# Altium project Weather Station.PrjPcb
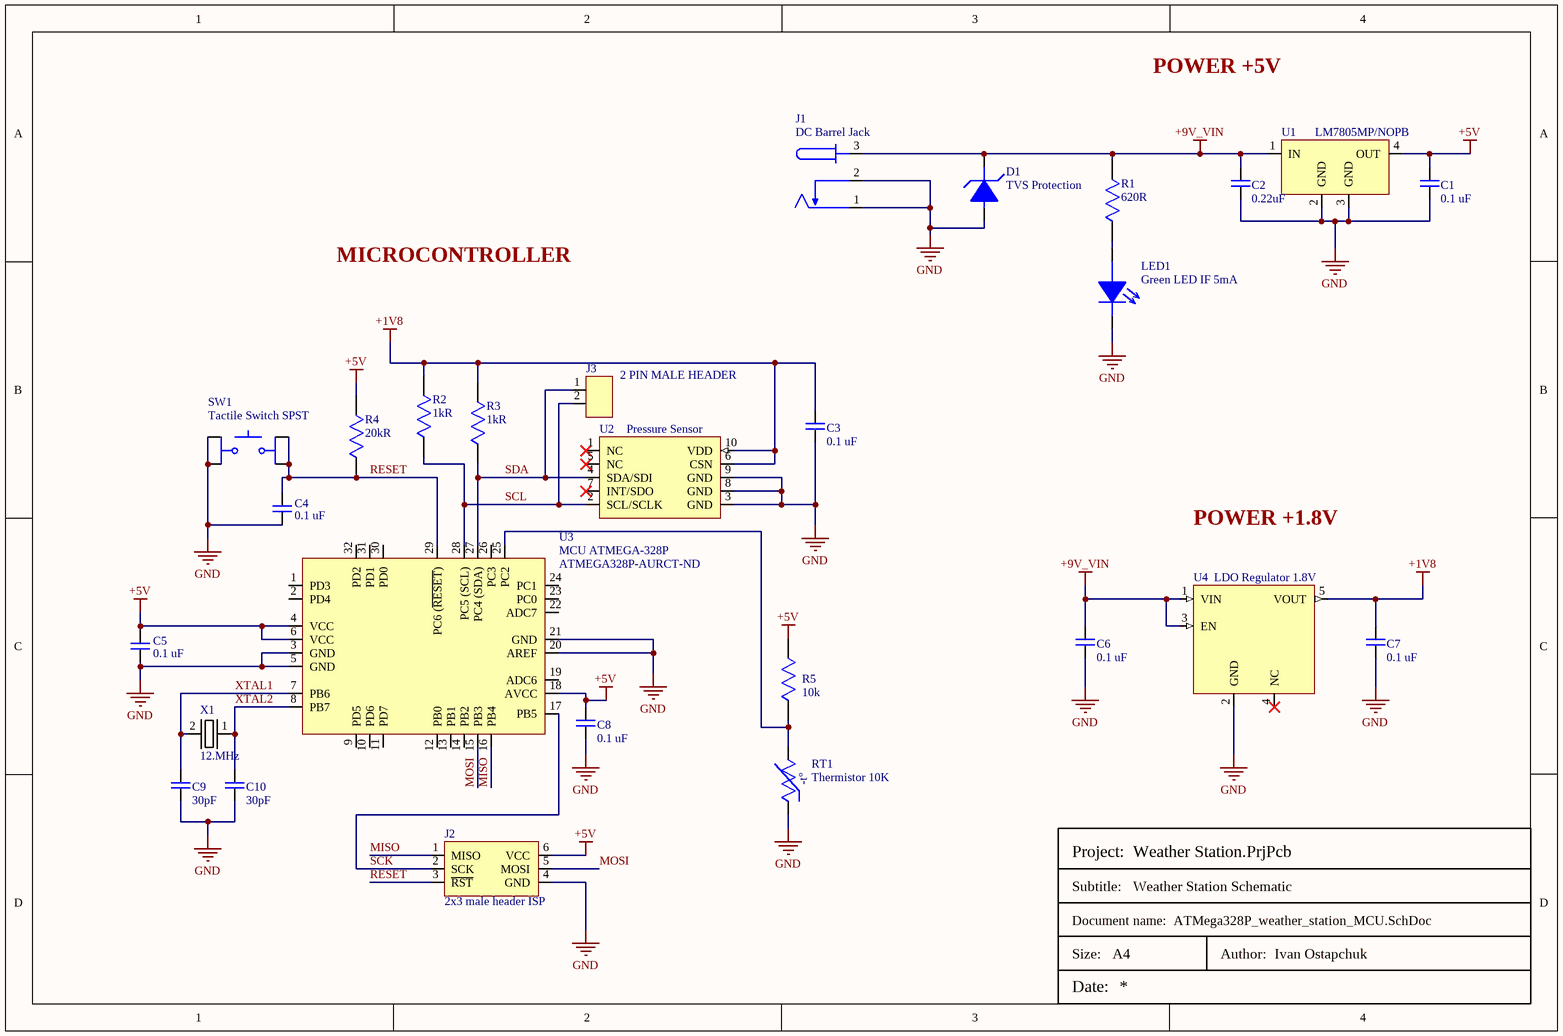
[diagram p0: ATMega328P_weather_station_MCU.SchDoc]
Author: Ivan Ostapchuk
1 sheet, 28 parts. Net scope: global (net labels, ports and power ports of the same name join across sheets).
Board file: Weather Station PCB.PcbDoc

## Sheet ATMega328P_weather_station_MCU.SchDoc
size A4; Author: Ivan Ostapchuk; DocumentNumber: 1; SheetNumber: 1; SheetTotal: 1

### Parts
*  Subtitle: Weather Station Schematic  Size: A4  (hidden comment: Title Block)  (graphical)
C1  0.1 uF  [1210B104K500CT]
C2  0.22uF  [Ceramic Cap 0.22uF 1210 Low density]
C3  0.1 uF  [1210B104K500CT]
C4  0.1 uF  [1210B104K500CT]
C5  0.1 uF  [1210B104K500CT]
C6  0.1 uF  [1210B104K500CT]
C7  0.1 uF  [1210B104K500CT]
C8  0.1 uF  [1210B104K500CT]
C9  30pF  [Kyocera 1210 Ceramic Capacitor]
C10  30pF  [Kyocera 1210 Ceramic Capacitor]
D1  TVS Protection  [Unidirectional TVS protection diode]
J1  DC Barrel Jack  [Power Barrel Jack]
J2  2x3 male header ISP  [2x3 male header ISP]
J3  2 PIN MALE HEADER  [2 pin male header smd]
LED1  Green LED IF 5mA  [SMD LED]
R1  620R  [1206 WIDE SMD Resistor]
R2  1kR  [Yageo 1206 SMD Resistor]
R3  1kR  [Yageo 1206 SMD Resistor]
R4  20kR  [Yageo 1206 SMD Resistor]
R5  10k  [Yageo 1206 SMD Resistor]
RT1  Thermistor 10K  [Yageo 1206 SMD Resistor]
SW1  Tactile Switch SPST  [Tactile Switch]
U1  Linear V Regulator  [LM7805MP/NOPB]  (value not drawn)
U2  Pressure Sensor  [XDCR_ENS220S-BLGT]
U3  MCU ATMEGA-328P  Supplier Part Number 1: ATMEGA328P-AURCT-ND  [QFP80P900X900X120-32N]
U4  LDO Regulator 1.8V  [LDO 1.8V]
X1  12.MHz  [ABLS-12.000MHZ-20-B-3-H-T]

### Nets
+1V8: C3.2 C7.1 R2.1 R3.1 U2.6(CSN) U2.10(VDD) U4.5(VOUT)
+5V: C1.1 C5.2 C8.2 J2.6(VCC) R4.1 R5.1 U1.4(OUT) U3.4(VCC) U3.6(VCC) U3.18(AVCC)
+9V_VIN: C2.1 C6.1 D1.2 J1.3(CENTER_(V+)) R1.2 U1.1(IN) U4.1(VIN) U4.3(EN)
GND: C1.2 C2.2 C3.1 C4.1 C5.1 C6.2 C7.2 C8.1 C9.1 C10.1 D1.1 J1.1(GND) J1.2(SPRING_(GND)) J2.4(GND) LED1.2 RT1.1 SW1.1 SW1.3 U1.2(GND) U1.3(GND) U2.3(GND) U2.8(GND) U2.9(GND) U3.3(GND) U3.5(GND) U3.20(AREF) U3.21(GND) U4.2(GND)
MISO: J2.1(MISO) U3.16(PB4)
MOSI: J2.5(MOSI) U3.15(PB3)
RESET: C4.2 J2.3(~{RST}) R4.2 SW1.2 SW1.4 U3.29(PC6_(~{RESET}))
SCK: J2.2(SCK) U3.17(PB5)
SCL: J3.2 R2.2 U2.2(SCL/SCLK) U3.28(PC5_(SCL))
SDA: J3.1 R3.2 U2.4(SDA/SDI) U3.27(PC4_(SDA))
XTAL1: C9.2 U3.7(PB6) X1.2
XTAL2: C10.2 U3.8(PB7) X1.1
NetLED1_1: LED1.1 R1.1
NetR5_2: R5.2 RT1.2 U3.25(PC2)

Not connected (* = marked no-connect by the designer): U2 1(NC)* 5(NC)* 7(INT/SDO)*; U3 1(PD3) 2(PD4) 9(PD5) 10(PD6) 11(PD7) 12(PB0) 13(PB1) 14(PB2) 19(ADC6) 22(ADC7) 23(PC0) 24(PC1) 26(PC3) 30(PD0) 31(PD1) 32(PD2); U4 4(NC)*

### Notes on the sheet
- POWER +5V
- MICROCONTROLLER
- POWER +1.8V
- (in symbol Thermistor NTC 10K) -t°
- (in symbol Title Block) Project:; Subtitle:; Document name:; Size:; Author:; Date:

### Library data of the parts
* = Title Block: Custom schematic title block
C1 C3-C8 = Ceramic Cap, 0.1 uF, 10%, 50 V, 1210: CerCapacitor, 0.1 uF, 10%, X7R, 50 V, 1210 [3225 Metric] Rohs Compliant: Yes |Walsin 1210B104K500CT; Manufacturer: Walsin Technologies; Capacitance: 100nF; Voltage Rating: 50V; Supplier 1: Digikey; Manufacturer Part Number: 1210B104K500CT; RoHS: Yes; Category: Ceramic Capacitors; Stock 1: 2921; Pricing 1: 1=0,23, 10=0,133, 50=0,0944, 100=0,0824, 500=0,06194, 1000=0,05558 (USD); Case/Package: Ceramic; Case Code (Metric): 3225; Case Code (Imperial): 1210; Min Operating Temperature: -55°C; Max Operating Temperature: 125°C; Packaging: Tape and Reel; Tolerance: 10%; Dielectric: X7R; Voltage Rating (DC): 50V; Length: 3.2mm; Depth: 2.5mm; Radiation Hardening: No; RoHS Compliant: Yes; Reach SVHC Compliant: Unknown; Lead Free: 5697LeadFree; ComponentLink1URL: https://datasheet.ciiva.com/26864/getdatasheetpartid-414729-26864951.pdf?src-supplier=Verical; ComponentLink1Description: https://datasheet.ciiva.com/26864/getdatasheetpartid-414729-26864951.pdf?src-supplier=Verical; Supplier Part Number 1: 1292-1618-6-ND
C2 = Ceramic Cap, 0.22uF, 10%, 50V, 1210: Multilayer Ceramic Capacitors MLCC - SMD/SMT 50V 0.22uF X7R 1210 10%; Manufacturer: KEMET; Manufacturer Part Number: C1210C224K5RACTU; Capacitance: 220nF; Supplier 1: Digikey; RoHS: Yes; Category: Ceramic Capacitors; Stock 1: 44512; Pricing 1: 1=0,26, 10=0,169, 50=0,1242, 100=0,1012, 500=0,07988, 1000=0,06745 (USD); Mount: Surface Mount,PCB; Case/Package: 1210; Number of Pins: 2; Case Code (Imperial): 1210; Case Code (Metric): 3225; Dielectric Material: Ceramic; Min Operating Temperature: -55°C; Max Operating Temperature: 125°C; Package Quantity: 1; Voltage Rating: 50V; Voltage Rating (DC): 50V; Tolerance: 10%; Packaging: Tape and Reel; Dielectric: X7R; Termination: SMD/SMT; Voltage: 50V; Series: C; Construction: Flat; Length: 3.2mm; Width: 0.098inch; Height: 0.9mm; Thickness: 0.039inch; Depth: 2.5mm; Radiation Hardening: No; Reach SVHC Compliant: No; RoHS Compliant: Yes; Lead Free: 5697LeadFree; ComponentLink1URL: https://datasheet.ciiva.com/5969/kem-c1002-x7r-smd-5969839.pdf?src-supplier=Farnell; ComponentLink1Description: https://datasheet.ciiva.com/5969/kem-c1002-x7r-smd-5969839.pdf?src-supplier=Farnell; ComponentLink2URL: https://datasheet.ciiva.com/7807/kem-c1002-x7r-smd-7807526.pdf?src-supplier=Element14; ComponentLink2Description: https://datasheet.ciiva.com/7807/kem-c1002-x7r-smd-7807526.pdf?src-supplier=Element14; ComponentLink3URL: https://datasheet.ciiva.com/28682/1851736-28682447.pdf?src-supplier=Element14; ComponentLink3Description: https://datasheet.ciiva.com/28682/1851736-28682447.pdf?src-supplier=Element14; Supplier Part Number 1: 399-C1210C224K5RAC7800DKR-ND
C9 C10 = Ceramic Cap, 30pF, ±5%, 200V, 1210: 30 pF ±5% 200V Ceramic Capacitor C0G, NP0 1210 (3225 Metric); Manufacturer: Kyocera AVX; Manufacturer Part Number: KGQ32DCG2D300JT; Supplier 1: Digikey; RoHS: No; Stock 1: 5835; Pricing 1: 1=0,65, 10=0,39, 50=0,2872, 100=0,2553, 500=0,20086, 1000=0,18387 (USD); Supplier Part Number 1: 478-KGQ32DCG2D300JTCT-ND
D1 = Unidirectional TVS protection Diode: Unidirectional TVS protection. SMAJ Series 10 V 400 W SMT Uni-Directional Transient Voltage Suppressor - SMA; Manufacturer: Littelfuse; Manufacturer Part Number: SMAJ10A; Supplier 1: Digikey; RoHS: Yes; Category: TVS Diodes; Stock 1: 44201; Pricing 1: 1=0,4, 10=0,287, 100=0,1449, 500=0,12844, 1000=0,09996, 2000=0,08947 (USD); ComponentLink1URL: https://datasheet.ciiva.com/330/littelfuse-tvs-diode-smaj-datasheet-pdf-330790.pdf?src-supplier=Digikey; ComponentLink1Description: https://datasheet.ciiva.com/330/littelfuse-tvs-diode-smaj-datasheet-pdf-330790.pdf?src-supplier=Digikey; ComponentLink2URL: https://datasheet.ciiva.com/330/littelfuse-tvs-diode-smaj-datasheet-pdf-330791.pdf?src-supplier=Digikey; ComponentLink2Description: https://datasheet.ciiva.com/330/littelfuse-tvs-diode-smaj-datasheet-pdf-330791.pdf?src-supplier=Digikey; ComponentLink3URL: https://datasheet.ciiva.com/330/littelfuse-tvs-diode-smaj-datasheet-pdf-330792.pdf?src-supplier=Digikey; ComponentLink3Description: https://datasheet.ciiva.com/330/littelfuse-tvs-diode-smaj-datasheet-pdf-330792.pdf?src-supplier=Digikey; ComponentLink4URL: https://datasheet.ciiva.com/8062/littelfuse-tvs-diode-smaj-8062262.pdf?src-supplier=Element14; ComponentLink4Description: https://datasheet.ciiva.com/8062/littelfuse-tvs-diode-smaj-8062262.pdf?src-supplier=Element14; Supplier Part Number 1: SMAJ10ALFCT-ND
J1 = Barrel Connector Jack: Power Barrel Connector Jack 2.05mm ID (0.081"), 5.50mm OD (0.217") Surface Mount, Right Angle; Manufacturer: Global Connector Technology; Manufacturer Part Number: DCJ200-05-A-K1-A; Supplier 1: Digikey; RoHS: Yes; Category: Connectors; Stock 1: 1981; Pricing 1: 1=1,02, 10=0,859, 25=0,8236, 50=0,806, 100=0,771 (USD); ComponentLink1URL: https://datasheet.octopart.com/DCJ200-05-A-K1-A-Global-Connector-Technology-datasheet-77992270.pdf?src-supplier=Future+Electronics; ComponentLink1Description: https://datasheet.octopart.com/DCJ200-05-A-K1-A-Global-Connector-Technology-datasheet-77992270.pdf?src-supplier=Future+Electronics; ComponentLink2URL: https://gct.co/files/drawings/dcj200-05.pdf?src-supplier=Digikey; ComponentLink2Description: https://gct.co/files/drawings/dcj200-05.pdf?src-supplier=Digikey; ComponentLink3URL: https://datasheet.octopart.com/DCJ200-05-A-K1-A-Global-Connector-Technology-datasheet-91940685.pdf?src-supplier=Farnell; ComponentLink3Description: https://datasheet.octopart.com/DCJ200-05-A-K1-A-Global-Connector-Technology-datasheet-91940685.pdf?src-supplier=Farnell; ComponentLink4URL: http://www.farnell.com/cad/1884037.pdf?src-supplier=Element14; ComponentLink4Description: http://www.farnell.com/cad/1884037.pdf?src-supplier=Element14; Supplier Part Number 1: 2073-DCJ200-05-A-K1-ACT-ND
J2 = 2x3 male header ISP: Bs Dr Vt SMT Hdr 2X3 TR-10125394-T0803ALF | Amphenol Fci (amphenol Cs) 10125394T0803ALF; Manufacturer: Amphenol Communications Solutions; Supplier 1: Digikey; Manufacturer Part Number: 10125394-T0803ALF; RoHS: No; Category: Backplane Connectors; Stock 1: 2253; Pricing 1: 1=0,66, 10=0,5 (USD)
J3 = 2 pin male header: Conn Unshrouded Header HDR 2 POS 2.54mm Solder ST SMD Automotive T/R; Manufacturer: Samtec; Manufacturer Part Number: TSM-102-01-T-SV-TR; Supplier 1: Digikey; RoHS: Yes; Category: Headers and Wire Housings; Stock 1: 4232; Pricing 1: 1=0,22 (USD); ComponentLink1URL: http://www.farnell.com/datasheets/1927672.pdf?src-supplier=Farnell; ComponentLink1Description: http://www.farnell.com/datasheets/1927672.pdf?src-supplier=Farnell; ComponentLink2URL: https://datasheet.octopart.com/TSM-102-01-T-SV-TR-Samtec-datasheet-41643181.pdf?src-supplier=Newark; ComponentLink2Description: https://datasheet.octopart.com/TSM-102-01-T-SV-TR-Samtec-datasheet-41643181.pdf?src-supplier=Newark; ComponentLink3URL: http://suddendocs.samtec.com/catalog_english/tsm.pdf?src-supplier=Digikey; ComponentLink3Description: http://suddendocs.samtec.com/catalog_english/tsm.pdf?src-supplier=Digikey; ComponentLink4URL: http://www.samtec.com/documents/webfiles/pdf/TSM.PDF?src-supplier=Avnet; ComponentLink4Description: http://www.samtec.com/documents/webfiles/pdf/TSM.PDF?src-supplier=Avnet; ComponentLink5URL: https://datasheet.octopart.com/TSM-102-01-T-SV-TR-Samtec-datasheet-97319594.pdf?src-supplier=Sager+Electronics; ComponentLink5Description: https://datasheet.octopart.com/TSM-102-01-T-SV-TR-Samtec-datasheet-97319594.pdf?src-supplier=Sager+Electronics; ComponentLink6URL: https://datasheet.octopart.com/TSM-102-01-T-SV-TR-Samtec-datasheet-116533474.pdf?src-supplier=Toby+Electronics; ComponentLink6Description: https://datasheet.octopart.com/TSM-102-01-T-SV-TR-Samtec-datasheet-116533474.pdf?src-supplier=Toby+Electronics; ComponentLink7URL: https://datasheet.octopart.com/TSM-102-01-T-SV-TR-Samtec-datasheet-141160580.pdf?src-supplier=Master+Electronics; ComponentLink7Description: https://datasheet.octopart.com/TSM-102-01-T-SV-TR-Samtec-datasheet-141160580.pdf?src-supplier=Master+Electronics; Supplier Part Number 1: SAM14779DKR-ND
LED1 = Green LED IF 5mA: Side View / 0805 / 2.1 X 1.0 X 0; Manufacturer: Inolux; Manufacturer Part Number: IN-S85CS5G; Supplier 1: Digikey; RoHS: No; Category: LEDs; Stock 1: 4626; Pricing 1: 1=0,25, 10=0,166, 100=0,1109, 500=0,07668, 1000=0,0639 (USD); Supplier Part Number 1: 1830-IN-S85CS5GDKR-ND
R1 = SMD Resistor 620 Ohms, 1.5W 1206 WIDE: 620 Ohms ±1% 1.5W Chip Resistor Wide 1206 (3216 Metric), 0612 Automotive AEC-Q200, Pulse Withstanding Thick Film; Manufacturer: Rohm; Manufacturer Part Number: LTR18EZPF6200; Max Power Dissipation: 750mW; Temperature Coefficient: 100ppm/°C; Voltage Rating: 200V; Supplier 1: Digikey; RoHS: No; Category: Chip SMD Resistors; Stock 1: 8335; Pricing 1: 1=0,2, 10=0,107, 50=0,073, 100=0,0629, 500=0,04618, 1000=0,0409 (USD); Case/Package: 0612; Case Code (Metric): 3216; Case Code (Imperial): 1206; Min Operating Temperature: -55°C; Max Operating Temperature: 155°C; Resistance: 620R; Tolerance: 1%; Packaging: Cut Tape; Number of Terminations: 2; Features: Automotive AEC-Q200; Series: LTR; Ratings: AEC-Q200; RoHS Compliant: No; ComponentLink1URL: https://datasheet.ciiva.com/2470/ltr-2470303.pdf?src-supplier=Digikey; ComponentLink1Description: https://datasheet.ciiva.com/2470/ltr-2470303.pdf?src-supplier=Digikey; ComponentLink2URL: https://datasheet.ciiva.com/2470/ltr-2470304.pdf?src-supplier=Digikey; ComponentLink2Description: https://datasheet.ciiva.com/2470/ltr-2470304.pdf?src-supplier=Digikey; ComponentLink3URL: https://datasheet.ciiva.com/2470/ltr-2470305.pdf?src-supplier=Digikey; ComponentLink3Description: https://datasheet.ciiva.com/2470/ltr-2470305.pdf?src-supplier=Digikey; Supplier Part Number 1: RHM620YCT-ND
R2 R3 = SMD Resistor 1 kOhm, 250mW, 1206: SMD Chip Resistor, 1 kOhm, ± 1%, 250 mW, 1206 [3216 Metric], Thick Film, General Purpose; Manufacturer: Yageo; Manufacturer Part Number: RC1206FR-071KL; Temperature Coefficient: 100ppm/°C; Power Rating: 250mW; Voltage Rating: 200V; Supplier 1: Digikey; RoHS: Yes; Category: Chip SMD Resistors; Stock 1: 367793; Pricing 1: 1=0,1, 10=0,038, 50=0,0244, 100=0,0206, 500=0,01434, 1000=0,01248 (USD); Case/Package: 1206; Case Code (Imperial): 1206; Case Code (Metric): 3216; Size Code: 1206; Min Operating Temperature: -55°C; Max Operating Temperature: 155°C; Resistance: 1kR; Tolerance: 1%; Packaging: Tape and Reel; Resistor Type: Thick Film; Termination: SMD/SMT; Series: RC; Resistance Tolerance: 1%; Voltage Rating (AC): 200V; Technology: THICK FILM; Length: 3.1mm; Height: 0.55mm; Depth: 1.6mm; Lead Free: Lead Free; Reach SVHC Compliant: Unknown; RoHS Compliant: Yes; Supplier Part Number 1: 311-1.00KFRDKR-ND
R4 = SMD Resistor, 20k Ohm, 250mW, 1206: 20 kOhm, ± 1%, 250 mW, SMD Resistor, 1206 [3216 Metric], Thick Film, General Purpose; Manufacturer: Yageo; Manufacturer Part Number: RC1206FR-0720KL; Voltage Rating (DC): 200V; Supplier 1: Digikey; RoHS: Yes; Category: Chip SMD Resistors; Stock 1: 254185; Pricing 1: 1=0,1, 10=0,038, 50=0,0244, 100=0,0206, 500=0,01434, 1000=0,01248 (USD); Lead Free: 5697LeadFree; ComponentLink1URL: http://www.yageo.com/documents/recent/PYu-RC_Group_51_RoHS_L_9.pdf?src-supplier=Digikey; ComponentLink1Description: http://www.yageo.com/documents/recent/PYu-RC_Group_51_RoHS_L_9.pdf?src-supplier=Digikey; ComponentLink2URL: http://www.yageo.com/documents/recent/PYu-RC_Group_51_RoHS_L_10.pdf?src-supplier=Digikey; ComponentLink2Description: http://www.yageo.com/documents/recent/PYu-RC_Group_51_RoHS_L_10.pdf?src-supplier=Digikey; Supplier Part Number 1: 311-20.0KFRCT-ND
R5 = SMD Resistor, 10 kOhm, 250 mW, 1206: SMD Chip Resistor, 10 kOhm, 1%, 250 mW, 1206 [3216 Metric], Thick Film, General Purpose; Manufacturer: Yageo; Manufacturer Part Number: RC1206FR-0710KL; Temperature Coefficient: 100ppm/°C; Power Rating: 250mW; Voltage Rating: 200V; Resistance: 10kR; Supplier 1: Digikey; RoHS: Yes; Category: Chip SMD Resistors; Stock 1: 2825737; Pricing 1: 1=0,1, 10=0,038, 50=0,0244, 100=0,0206, 500=0,01434, 1000=0,01248 (USD); Case/Package: 1206; Case Code (Imperial): 1206; Case Code (Metric): 3216; Size Code: 1206; Min Operating Temperature: -55°C; Max Operating Temperature: 155°C; Tolerance: 1%; Packaging: Tape and Reel; Resistor Type: Thick Film; Termination: SMD/SMT; Series: RC; Resistance Tolerance: 1%; Features: Moisture Resistant; Max Power Dissipation: 250mW; Number of Terminations: 2; Voltage Rating (AC): 200V; Package Quantity: 5000; Length: 3.1mm; Width: 1.6mm; Height: 0.55mm; Reach SVHC Compliant: Unknown; Lead Free: 5697LeadFree; RoHS Compliant: Yes; ComponentLink1URL: https://datasheet.ciiva.com/46445/444357-46445703.pdf?src-supplier=Element14; ComponentLink1Description: https://datasheet.ciiva.com/46445/444357-46445703.pdf?src-supplier=Element14; ComponentLink2URL: https://datasheet.ciiva.com/7857/1692832-7857244.pdf?src-supplier=Element14; ComponentLink2Description: https://datasheet.ciiva.com/7857/1692832-7857244.pdf?src-supplier=Element14; ComponentLink3URL: https://datasheet.ciiva.com/7857/1692832-7857245.pdf?src-supplier=Element14; ComponentLink3Description: https://datasheet.ciiva.com/7857/1692832-7857245.pdf?src-supplier=Element14; Supplier Part Number 1: 311-10.0KFRCT-ND
RT1 = Thermistor NTC 10K: Thermistor NTC 10K Ohm 10% 2-Pin 1206 Surface Mount Solder Pad 3510K Blister T/R; Manufacturer: TDK EPCOS; Manufacturer Part Number: B57621C5103K062; Resistance: 10kR; Power Rating: 300mW; Supplier 1: Digikey; RoHS: Yes; Category: Thermistors; Stock 1: 7290; Pricing 1: 1=1,17, 10=0,878, 25=0,7024, 100=0,6439, 500=0,5415, 1000=0,48295 (USD); Case/Package: 1206; Number of Pins: 2; Weight: 0.000635oz; Min Operating Temperature: -55°C; Max Operating Temperature: 125°C; Packaging: Tape and Reel; Tolerance: 10%; Package Quantity: 4000; Termination: SMD/SMT; Series: *; Length: 3.2mm; Width: 1.6mm; Height: 1.3mm; Depth: 1.6mm; Radiation Hardening: No; RoHS Compliant: Yes; ComponentLink1URL: https://datasheet.ciiva.com/15097/getdatasheetpartid-382188-15097872.pdf?src-supplier=Verical; ComponentLink1Description: https://datasheet.ciiva.com/15097/getdatasheetpartid-382188-15097872.pdf?src-supplier=Verical; Supplier Part Number 1: 495-B57621C5103K062CT-ND
SW1 = Tactile Switch SPST: TL3305A Series SPST 12 V 4.5 x 4.5 mm 260 gf Top Actuated SMT Tactile Switch; Manufacturer: E-Switch; Manufacturer Part Number: TL3305AF260QG; Mechanical Life: 200000Cycles; Illumination Type: Non-Illuminated; Operating Force: 260gf; Switch Travel: 0.2mm; Switch Function: Off-Mom; Actuator Type: Standard; Supplier 1: Digikey; RoHS: No; Category: Tactile Switches; Stock 1: 157478; Pricing 1: 1=0,21, 10=0,205, 25=0,1944, 100=0,176, 250=0,16048, 500=0,14918, 1000=0,12726 (USD); Mount: Surface Mount; Min Operating Temperature: -20°C; Max Operating Temperature: 70°C; Packaging: Cut Tape; Termination: Gull Wing; Throw Configuration: SPST; Series: TL3305; Lead Free: Lead Free; ComponentLink1URL: http://www.farnell.com/datasheets/2554191.pdf?src-supplier=Farnell; ComponentLink1Description: http://www.farnell.com/datasheets/2554191.pdf?src-supplier=Farnell; ComponentLink2URL: http://www.farnell.com/datasheets/2554191.pdf?src-supplier=Newark; ComponentLink2Description: http://www.farnell.com/datasheets/2554191.pdf?src-supplier=Newark; ComponentLink3URL: http://spec_sheets.e-switch.com/specs/P010471.pdf?src-supplier=Mouser; ComponentLink3Description: http://spec_sheets.e-switch.com/specs/P010471.pdf?src-supplier=Mouser; ComponentLink4URL: http://www.farnell.com/datasheets/2554191.pdf?src-supplier=Element14; ComponentLink4Description: http://www.farnell.com/datasheets/2554191.pdf?src-supplier=Element14; ComponentLink5URL: http://spec_sheets.e-switch.com/specs/P010471.pdf?src-supplier=Digikey; ComponentLink5Description: http://spec_sheets.e-switch.com/specs/P010471.pdf?src-supplier=Digikey; ComponentLink6URL: http://spec_sheets.e-switch.com/specs/P010471.pdf?src-supplier=NAC+Semi; ComponentLink6Description: http://spec_sheets.e-switch.com/specs/P010471.pdf?src-supplier=NAC+Semi; Supplier Part Number 1: EG5353DKR-ND
U1 = Linear Voltage Regulator LM7805MP/NOPB: 1.5-A, 30-V, linear voltage regulator 4-SOT-223 0 to 125; Manufacturer: Texas Instruments; Dropout Voltage: 2V; Accuracy: 3%; Max Supply Voltage: 30V; Min Supply Voltage: 7.5V; Nominal Supply Current: 8mA; Number of Outputs: 1NUMBER; Output Voltage: 5V; Supplier 1: Digikey; Manufacturer Part Number: LM7805MP/NOPB; RoHS: Yes; Category: Voltage Regulators - Linear; Stock 1: 2585; Pricing 1: 1=1,73, 10=1,555, 25=1,4672, 100=1,2499, 250=1,1736, 500=1,02692 (USD); Number of Pins: 4NUMBER; Length: 6.5mm; Width: 3.5mm; Height: 1.8mm; Thickness: 1.6mm; Lead Free: 5698LeadFree; ComponentLink1URL: http://www.ti.com/general/docs/suppproductinfo.tsp?distId=10&amp;gotoUrl=http%3A%2F%2Fwww.ti.com%2Flit%2Fgpn%2Flm340&src-supplier=Digikey; ComponentLink1Description: http://www.ti.com/general/docs/suppproductinfo.tsp?distId=10&amp;gotoUrl=http%3A%2F%2Fwww.ti.com%2Flit%2Fgpn%2Flm340&src-supplier=Digikey; Supplier Part Number 1: 296-44517-1-ND
U2 = Pressure Sensor: Pressure Sensor 4.35PSI ~ 17.4PSI (30kPa ~ 120kPa) Absolute 24 b 10-LGA; Manufacturer: ScioSense; Manufacturer Part Number: ENS220S-BLGT; Supplier 1: Digikey; RoHS: No; Stock 1: 2645; Pricing 1: 1=3,45, 10=2,591, 25=2,3028, 50=2,1876, 100=2,1301, 500=1,78468, 1000=1,66953 (USD); Supplier Part Number 1: 2618-ENS220S-BLGTCT-ND
U3 = MCU ATMEGA-328P: AVR series Microcontroller IC 8-Bit 2MHz 32KB (16K x 16) FLASH 32-TQFP (7x7); Manufacturer: Microchip; Manufacturer Part Number: ATMEGA328P-AUR; Interface: I2C,SPI,UART,USART; Oscillator Type: Internal; Peripherals: Brown-out Detect/Reset,POR,PWM,WDT; Number of I/Os: 23; Core Architecture: PIC; Data Bus Width: 8b; Max Frequency: 20MHz; Max Supply Voltage: 5.5V; Min Supply Voltage: 1.8V; Number of ADC Channels: 8NUMBER; Number of I2C Channels: 1NUMBER; Number of Programmable I/O: 23NUMBER; Number of PWM Channels: 6NUMBER; Number of SPI Channels: 2NUMBER; Number of Timers/Counters: 3NUMBER; RAM Size: 2KB; Watchdog Timer: 5512WatchdogTimer; Supplier 1: Digikey; RoHS: Yes; Category: Microcontrollers; Stock 1: 111026; Pricing 1: 1=2,74, 25=2,54, 100=2,3 (USD); Mount: Surface Mount; Case/Package: TQFP; Number of Pins: 32; Contact Plating: 154ConductorMaterial; Min Operating Temperature: -40°C; Max Operating Temperature: 85°C; Packaging: Cut Tape; Memory Type: FLASH; Memory Size: 32KB; Series: PIC® 18F; Number of UART Channels: 1NUMBER; Height: 1.2mm; RoHS Compliant: Yes; Lead Free: 5697LeadFree; Reach SVHC Compliant: 4186SVHC; ComponentLink1URL: http://www.farnell.com/datasheets/2047852.pdf?src-supplier=Farnell; ComponentLink1Description: http://www.farnell.com/datasheets/2047852.pdf?src-supplier=Farnell; ComponentLink2URL: http://components.arrow.com/part/dataview/48719204S8832641N3744?src-supplier=Arrow+Electronics; ComponentLink2Description: http://components.arrow.com/part/dataview/48719204S8832641N3744?src-supplier=Arrow+Electronics; ComponentLink3URL: http://www.produktinfo.conrad.com/datenblaetter/1200000-1299999/001267077-da-01-en-IC_MCU_8BIT_3_ATMEGA328P_AUR_TQFP_32_ATM.pdf?src-supplier=Conrad; ComponentLink3Description: http://www.produktinfo.conrad.com/datenblaetter/1200000-1299999/001267077-da-01-en-IC_MCU_8BIT_3_ATMEGA328P_AUR_TQFP_32_ATM.pdf?src-supplier=Conrad; ComponentLink4URL: https://datasheet.octopart.com/ATMEGA328P-AUR-Microchip-datasheet-14421303.pdf?src-supplier=Newark; ComponentLink4Description: https://datasheet.octopart.com/ATMEGA328P-AUR-Microchip-datasheet-14421303.pdf?src-supplier=Newark; ComponentLink5URL: http://www.farnell.com/datasheets/2047852.pdf?src-supplier=Element14; ComponentLink5Description: http://www.farnell.com/datasheets/2047852.pdf?src-supplier=Element14; ComponentLink6URL: https://datasheet.octopart.com/ATMEGA328P-AUR-Microchip-datasheet-101746195.pdf?src-supplier=Future+Electronics; ComponentLink6Description: https://datasheet.octopart.com/ATMEGA328P-AUR-Microchip-datasheet-101746195.pdf?src-supplier=Future+Electronics; ComponentLink7URL: http://www.farnell.com/datasheets/1693866.pdf?src-supplier=Newark; ComponentLink7Description: http://www.farnell.com/datasheets/1693866.pdf?src-supplier=Newark; ComponentLink8URL: http://www.microchip.com/mymicrochip/filehandler.aspx?ddocname=en589968&src-supplier=Digikey; ComponentLink8Description: http://www.microchip.com/mymicrochip/filehandler.aspx?ddocname=en589968&src-supplier=Digikey; ComponentLink9URL: http://www.microchip.com/mymicrochip/filehandler.aspx?ddocname=en608326&src-supplier=Digikey; ComponentLink9Description: http://www.microchip.com/mymicrochip/filehandler.aspx?ddocname=en608326&src-supplier=Digikey; ComponentLink10URL: https://datasheet.octopart.com/ATMEGA328P-AUR-Microchip-datasheet-133520744.pdf?src-supplier=LKR; ComponentLink10Description: https://datasheet.octopart.com/ATMEGA328P-AUR-Microchip-datasheet-133520744.pdf?src-supplier=LKR; ComponentLink11URL: https://datasheet.octopart.com/ATMEGA328P-AUR-Microchip-datasheet-154741723.pdf?src-supplier=Electro+Sonic; ComponentLink11Description: https://datasheet.octopart.com/ATMEGA328P-AUR-Microchip-datasheet-154741723.pdf?src-supplier=Electro+Sonic; ComponentLink12URL: https://datasheet.octopart.com/ATMEGA328P-AUR-Microchip-datasheet-68295846.pdf?src-supplier=SHENGYU+ELECTRONICS; ComponentLink12Description: https://datasheet.octopart.com/ATMEGA328P-AUR-Microchip-datasheet-68295846.pdf?src-supplier=SHENGYU+ELECTRONICS
U4 = LDO Regulator 1.8V: Linear Voltage Regulator IC Positive Fixed 1 Output 1.8V 300mA SOT-23-5; Manufacturer: Microchip; Manufacturer Part Number: MIC5504-1.8YM5-TR; Supplier 1: Digikey; RoHS: Yes; Category: Voltage Regulators - Linear; Stock 1: 215403; Pricing 1: 1=0,16, 25=0,12, 100=0,11 (USD); ComponentLink1URL: http://www.microchip.com/mymicrochip/filehandler.aspx?ddocname=en580292&src-supplier=Digikey; ComponentLink1Description: http://www.microchip.com/mymicrochip/filehandler.aspx?ddocname=en580292&src-supplier=Digikey; ComponentLink2URL: http://ww1.microchip.com/downloads/en/DeviceDoc/MIC550X.pdf?src-supplier=Farnell; ComponentLink2Description: http://ww1.microchip.com/downloads/en/DeviceDoc/MIC550X.pdf?src-supplier=Farnell; ComponentLink3URL: https://datasheet.octopart.com/MIC5504-1.8YM5-TR-Microchip-datasheet-137404938.pdf?src-supplier=Future+Electronics; ComponentLink3Description: https://datasheet.octopart.com/MIC5504-1.8YM5-TR-Microchip-datasheet-137404938.pdf?src-supplier=Future+Electronics; ComponentLink4URL: http://ww1.microchip.com/downloads/en/DeviceDoc/MIC550X.pdf?src-supplier=Newark; ComponentLink4Description: http://ww1.microchip.com/downloads/en/DeviceDoc/MIC550X.pdf?src-supplier=Newark; ComponentLink5URL: https://datasheet.octopart.com/MIC5504-1.8YM5-TR-Microchip-datasheet-137404938.pdf?src-supplier=Electro+Sonic; ComponentLink5Description: https://datasheet.octopart.com/MIC5504-1.8YM5-TR-Microchip-datasheet-137404938.pdf?src-supplier=Electro+Sonic; Supplier Part Number 1: 576-4879-6-ND
X1 = ABLS-12.000MHZ-20-B-3-H-T: Crystal 12MHz ±25ppm (Tol) ±35ppm (Stability) 20pF FUND 50Ohm 2-Pin HC-49/US SMD T/R; Manufacturer: Abracon; Supplier 1: Digikey; Manufacturer Part Number: ABLS-12.000MHZ-20-B-3-H-T; RoHS: Yes; Category: Crystals; Stock 1: 9001; Pricing 1: 1=0,19, 10=0,16, 50=0,1444, 100=0,1381, 500=0,12446 (USD); ComponentLink1URL: https://abracon.com/Resonators/abls.pdf?src-supplier=Digikey; ComponentLink1Description: https://abracon.com/Resonators/abls.pdf?src-supplier=Digikey; ComponentLink2URL: https://datasheet.octopart.com/ABLS-12.000MHZ-20-B-3-H-T-Abracon-datasheet-139816269.pdf?src-supplier=Electro+Sonic; ComponentLink2Description: https://datasheet.octopart.com/ABLS-12.000MHZ-20-B-3-H-T-Abracon-datasheet-139816269.pdf?src-supplier=Electro+Sonic; Supplier Part Number 1: 535-15006-1-ND